# EAGLE design audio_processor (EAGLE 9.6.0)
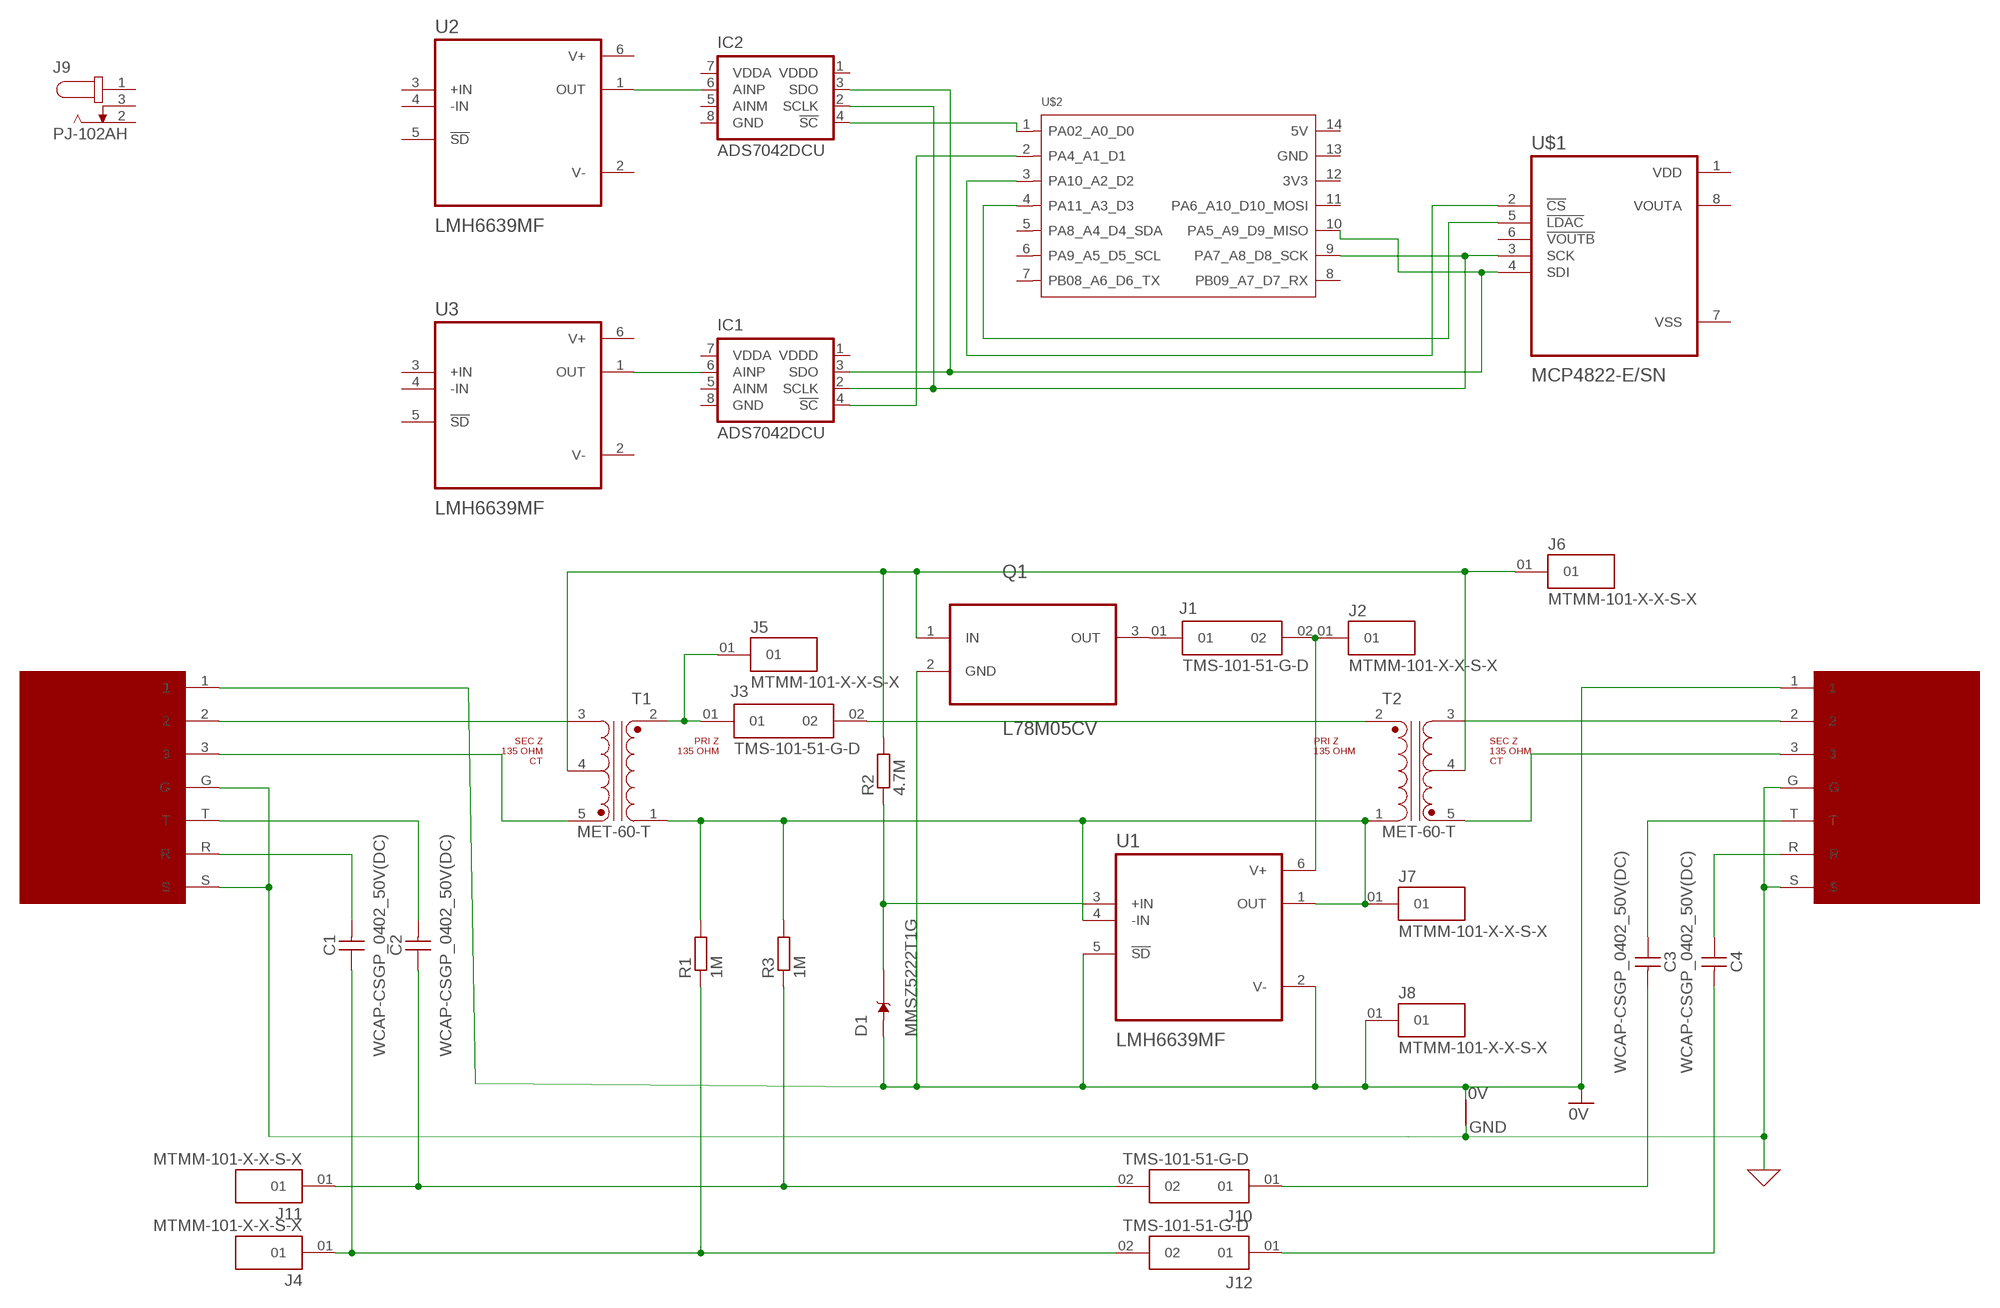
[diagram p0: schematic, sheet 1]

## Parts
B1  NET_BRIDGE  [NET_BRIDGE]
C1  WCAP-CSGP_0402_50V(DC)  [WCAP-CSGP_0402]
C2  WCAP-CSGP_0402_50V(DC)  [WCAP-CSGP_0402]
C3  WCAP-CSGP_0402_50V(DC)  [WCAP-CSGP_0402]
C4  WCAP-CSGP_0402_50V(DC)  [WCAP-CSGP_0402]
C5  XLR-TRS-THRU-HOLE-FEMALE-AMPHENOL  [XLR-TRS-THRU-HOLE-FEMALE-AMPHENOL]
C6  XLR-TRS-THRU-HOLE-FEMALE-AMPHENOL  [XLR-TRS-THRU-HOLE-FEMALE-AMPHENOL]
D1  MMSZ5222T1G  MMSZ4693T1G  [SOD3716X135N]
IC1  ADS7042DCU  [DCU_(R-PDSO-G8)]
IC2  ADS7042DCU  [DCU_(R-PDSO-G8)]
J1  TMS-101-51-G-D  [SAMTEC_TMS-101-51-G-D]
J2  MTMM-101-X-X-S-X  [SAMTEC_MTMM-101-X-X-S-X]
J3  TMS-101-51-G-D  [SAMTEC_TMS-101-51-G-D]
J4  MTMM-101-X-X-S-X  [SAMTEC_MTMM-101-X-X-S-X]
J5  MTMM-101-X-X-S-X  [SAMTEC_MTMM-101-X-X-S-X]
J6  MTMM-101-X-X-S-X  [SAMTEC_MTMM-101-X-X-S-X]
J7  MTMM-101-X-X-S-X  [SAMTEC_MTMM-101-X-X-S-X]
J8  MTMM-101-X-X-S-X  [SAMTEC_MTMM-101-X-X-S-X]
J9  PJ-102AH  [CUI_PJ-102AH]
J10  TMS-101-51-G-D  [SAMTEC_TMS-101-51-G-D]
J11  MTMM-101-X-X-S-X  [SAMTEC_MTMM-101-X-X-S-X]
J12  TMS-101-51-G-D  [SAMTEC_TMS-101-51-G-D]
Q1  L78M05CV  [TO254P450X1020X1935-3P]
R1  1M  R-EU_R0402  [R0402]
R2  4.7M  R-EU_R0402  [R0402]
R3  1M  R-EU_R0402  [R0402]
T1  MET-60-T  [XFMR_MET-60-T]
T2  MET-60-T  [XFMR_MET-60-T]
U1  LMH6639MF  [SOT95P280X145-6N]
U2  LMH6639MF  [SOT95P280X145-6N]
U3  LMH6639MF  [SOT95P280X145-6N]
U$1  MCP4822-E/SN  [SOIC127P599X175-8N]
U$2  SEEED_ESP32_C3  [MOUDLE14P-2.54-21X17.8MM]

## Nets
0V [Power]: B1.P$1 C5.1 C6.1 D1.2(A) J8.01 Q1.2(GND) U1.2(V-) U1.5(!SD)
GND [Power]: B1.P$2 C5.G C5.S C6.G C6.S
N$1 [Power]: C6.2 T1.3
N$2 [Power]: C6.3 T1.5
N$3 [Power]: C5.2 T2.3
N$4 [Power]: C5.3 T2.5
N$5 [Power]: J6.01 Q1.1(IN) R2.2 T1.4 T2.4
N$6: D1.1(C) R2.1 U1.3(+IN)
N$7: J7.01 R1.2 R3.2 T1.1 T2.1 U1.1(OUT) U1.4(-IN)
N$8: C1.1 J4.01 J12.02 R1.1
N$9: J3.01 J5.01 T1.2
N$10: J3.02 T2.2
N$11: C3.2 J10.01
N$12: C4.1 C5.R
N$13: C2.2 C6.T
N$14: J1.01 Q1.3(OUT)
N$15: C1.2 C6.R
N$16: C2.1 J10.02 J11.01 R3.1
N$17: C3.1 C5.T
N$18: C4.2 J12.01
N$19 [Power]: J1.02 J2.01 U1.6(V+)
N$20: U$1.5(!LDAC) U$2.4(PA11_A3_D3)
N$21: IC1.2(SCLK) IC2.2(SCLK) U$1.3(SCK) U$2.9(PA7_A8_D8_SCK)
N$22: IC2.6(AINP) U2.1(OUT)
N$23: IC1.6(AINP) U3.1(OUT)
N$24: IC1.3(SDO) IC2.3(SDO) U$1.4(SDI) U$2.10(PA5_A9_D9_MISO)
N$25: IC1.4(!SC) U$2.2(PA4_A1_D1)
N$26: IC2.4(!SC) U$2.1(PA02_A0_D0)
N$28: U$1.2(!CS) U$2.3(PA10_A2_D2)
Unconnected: IC1.5(AINM) IC2.5(AINM) J9.1 J9.2 J9.3 U2.3(+IN) U2.4(-IN) U2.5(!SD) U3.3(+IN) U3.4(-IN) U3.5(!SD) U$1.6(!VOUTB) U$1.8(VOUTA) U$2.5(PA8_A4_D4_SDA) U$2.6(PA9_A5_D5_SCL) U$2.7(PB08_A6_D6_TX) U$2.8(PB09_A7_D7_RX) U$2.11(PA6_A10_D10_MOSI) U$2.12(3V3) U$2.13(GND) U$2.14(5V)

## Power pins joined to a net without a drawn wire
GND: IC1.8(GND) IC2.8(GND)
V+: U2.6(V+) U3.6(V+)
V-: U2.2(V-) U3.2(V-)
VDD: U$1.1(VDD)
VDDA: IC1.7(VDDA) IC2.7(VDDA)
VDDD: IC1.1(VDDD) IC2.1(VDDD)
VSS: U$1.7(VSS)

## Library data of the parts
B1 = Net_bridge:NET_BRIDGE: Bridge between two, otherwise isolated, nets.
C1-C4 = WCAP-CSGP_0402:WCAP-CSGP_0402: Check availability <https://pricing.snapeda.com/parts/885012105010/W%C3%BCrth%20Elektronik/view-part?ref=eda>; AVAILABILITY: In Stock; CHECK_PRICES: https://www.snapeda.com/parts/885012105010/W%25C3%25BCrth+Elektronik+Midcom/view-part/?ref=eda; DESCRIPTION: WCAP-CSGP General Purpose MLCC; SMT 0402; X5R; 100nF 20%; 10V; -55C to +85C; Tech. PN X5R0402104M010DFCT10000; LCSC: C1581; MF: Würth Elektronik; MP: 885012105010; PACKAGE: 0402 Wurth Electronics; PRICE: None; SNAPEDA_LINK: https://www.snapeda.com/parts/885012105010/W%25C3%25BCrth+Elektronik+Midcom/view-part/?ref=snap
C5 C6 = TM_Lib:XLR-TRS-THRU-HOLE-FEMALE-AMPHENOL: AN AMPHENOL PCB CONNECTOR FOR A COMBINATION OF XLR AND TRS - FEMALE
D1 = MMSZ4693T1G:MMSZ4693T1G: Check availability <https://pricing.snapeda.com/parts/MMSZ4693T1G/ON%20Semiconductor/view-part?ref=eda>; AVAILABILITY: In Stock; CHECK_PRICES: https://www.snapeda.com/parts/MMSZ4693T1G/Onsemi/view-part/?ref=eda; DESCRIPTION: MMSZ4693T1G Zener Diode, 7.5V 5% 500 mW SMT 2-Pin SOD-123 | ON Semiconductor MMSZ4693T1G; LCSC: C150078; MF: ON Semiconductor; MP: MMSZ4693T1G; PACKAGE: SOD-123-2 ON Semiconductor; PRICE: None; SNAPEDA_LINK: https://www.snapeda.com/parts/MMSZ4693T1G/Onsemi/view-part/?ref=snap
IC1 IC2 = Texas Instruments:ADS7042: ADS7042 Ultra-Low Power, Ultra-Small Size, 12-Bit, 1-MSPS, SAR ADC Soure: Data sheet <http://www.ti.com/lit/ds/symlink/ads7042.pdf>
J1 J3 J10 J12 = TMS-101-51-G-D:TMS-101-51-G-D: Check availability <https://pricing.snapeda.com/parts/TMS-101-51-G-D/Samtec/view-part?ref=eda>; AVAILABILITY: In Stock; CHECK_PRICES: https://www.snapeda.com/parts/TMS-101-51-G-D/Samtec/view-part/?ref=eda; DESCRIPTION: Connector Header Through Hole 2 position; MF: Samtec; MP: TMS-101-51-G-D; PACKAGE: None; PRICE: None; SNAPEDA_LINK: https://www.snapeda.com/parts/TMS-101-51-G-D/Samtec/view-part/?ref=snap
J2 J4-J8 J11 = MTMM-101-X-X-S-X:MTMM-101-X-X-S-X: Check availability <https://pricing.snapeda.com/parts/MTMM-101-05-T-S-208/Samtec/view-part?ref=eda>; AVAILABILITY: In Stock; CHECK_PRICES: https://www.snapeda.com/parts/MTMM-101-05-T-S-208/Samtec/view-part/?ref=eda; DESCRIPTION: Connector Header Through Hole 1 position; MF: Samtec; MP: MTMM-101-05-T-S-208; PACKAGE: None; PRICE: None; SNAPEDA_LINK: https://www.snapeda.com/parts/MTMM-101-05-T-S-208/Samtec/view-part/?ref=snap
J9 = PJ-102AH:PJ-102AH: Check availability <https://pricing.snapeda.com/parts/PJ-102AH/Same%20Sky/view-part?ref=eda>; AVAILABILITY: In Stock; CHECK_PRICES: https://www.snapeda.com/parts/PJ-102AH/Same+Sky/view-part/?ref=eda; DESCRIPTION: 2.0 x 6.5 mm, 5.0 A, Horizontal, Through Hole, Tapered Pins, Dc Power Jack Connector; MF: Same Sky; MP: PJ-102AH; PACKAGE: None; PRICE: None; SNAPEDA_LINK: https://www.snapeda.com/parts/PJ-102AH/Same+Sky/view-part/?ref=snap
Q1 = L78M05CV:L78M05CV: Check availability <https://pricing.snapeda.com/parts/L78M05CV/STMicroelectronics/view-part?ref=eda>; AVAILABILITY: In Stock; CHECK_PRICES: https://www.snapeda.com/parts/L78M05CV/STMicroelectronics/view-part/?ref=eda; DESCRIPTION: Linear Voltage Regulator IC Positive Fixed 1 Output 500mA TO-220; LCSC: C283462; MF: STMicroelectronics; MP: L78M05CV; PACKAGE: TO-220-3 STMicroelectronics; PRICE: None; SNAPEDA_LINK: https://www.snapeda.com/parts/L78M05CV/STMicroelectronics/view-part/?ref=snap
R1 R3 = rcl:R-EU_: RESISTOR, European symbol; LCSC: C26083; SPICEPREFIX: R
R2 = rcl:R-EU_: RESISTOR, European symbol; LCSC: C26091; SPICEPREFIX: R
T1 T2 = MET-60-T:MET-60-T: Check availability <https://pricing.snapeda.com/parts/MET-60-T/Triad%20Magnetics/view-part?ref=eda>; AVAILABILITY: In Stock; CHECK_PRICES: https://www.snapeda.com/parts/MET-60-T/Triad+Magnetics/view-part/?ref=eda; DESCRIPTION: 135 Impedance Primary Ohms 135CT Impedance Secondary Ohms 1:1 Audio Transformer 300Hz ~ 100kHz Through Hole; MF: Triad Magnetics; MP: MET-60-T; PACKAGE: None; PRICE: None; SNAPEDA_LINK: https://www.snapeda.com/parts/MET-60-T/Triad+Magnetics/view-part/?ref=snap
U1-U3 = LMH6639MF:LMH6639MF: Check availability <https://pricing.snapeda.com/parts/LMH6639MF/Texas%20Instruments/view-part?ref=eda>; AVAILABILITY: In Stock; CHECK_PRICES: https://www.snapeda.com/parts/LMH6639MF/Texas+Instruments/view-part/?ref=eda; DESCRIPTION: 190MHz Rail-to-Rail Output Amplifier with Disable 6-SOT-23 -40 to 85; LCSC: C131982; MF: Texas Instruments; MP: LMH6639MF; PACKAGE: SOT-23-6 Texas Instruments; PRICE: None; SNAPEDA_LINK: https://www.snapeda.com/parts/LMH6639MF/Texas+Instruments/view-part/?ref=snap
U$1 = MCP4822-E_SN:MCP4822-E/SN: Check availability <https://pricing.snapeda.com/parts/MCP4822-E/SN/Microchip/view-part?ref=eda>; AVAILABILITY: In Stock; CHECK_PRICES: https://www.snapeda.com/parts/MCP4822-E/SN/Microchip/view-part/?ref=eda; DESCRIPTION: Dual 12-Bit Dac With Spi Interace And Internal Vref, Soic-8 | Microchip Technology Inc. MCP4822-E/SN; MF: Microchip; MP: MCP4822-E/SN; PACKAGE: SO-8 Microchip; PRICE: None; SNAPEDA_LINK: https://www.snapeda.com/parts/MCP4822-E/SN/Microchip/view-part/?ref=snap
U$2 = XIAO-ESP32C3:SEEED_ESP32_C3: SEEED ESP C3 internal antenna non-SMD

## Net classes
1 Power: width 0.5 mm

## Board
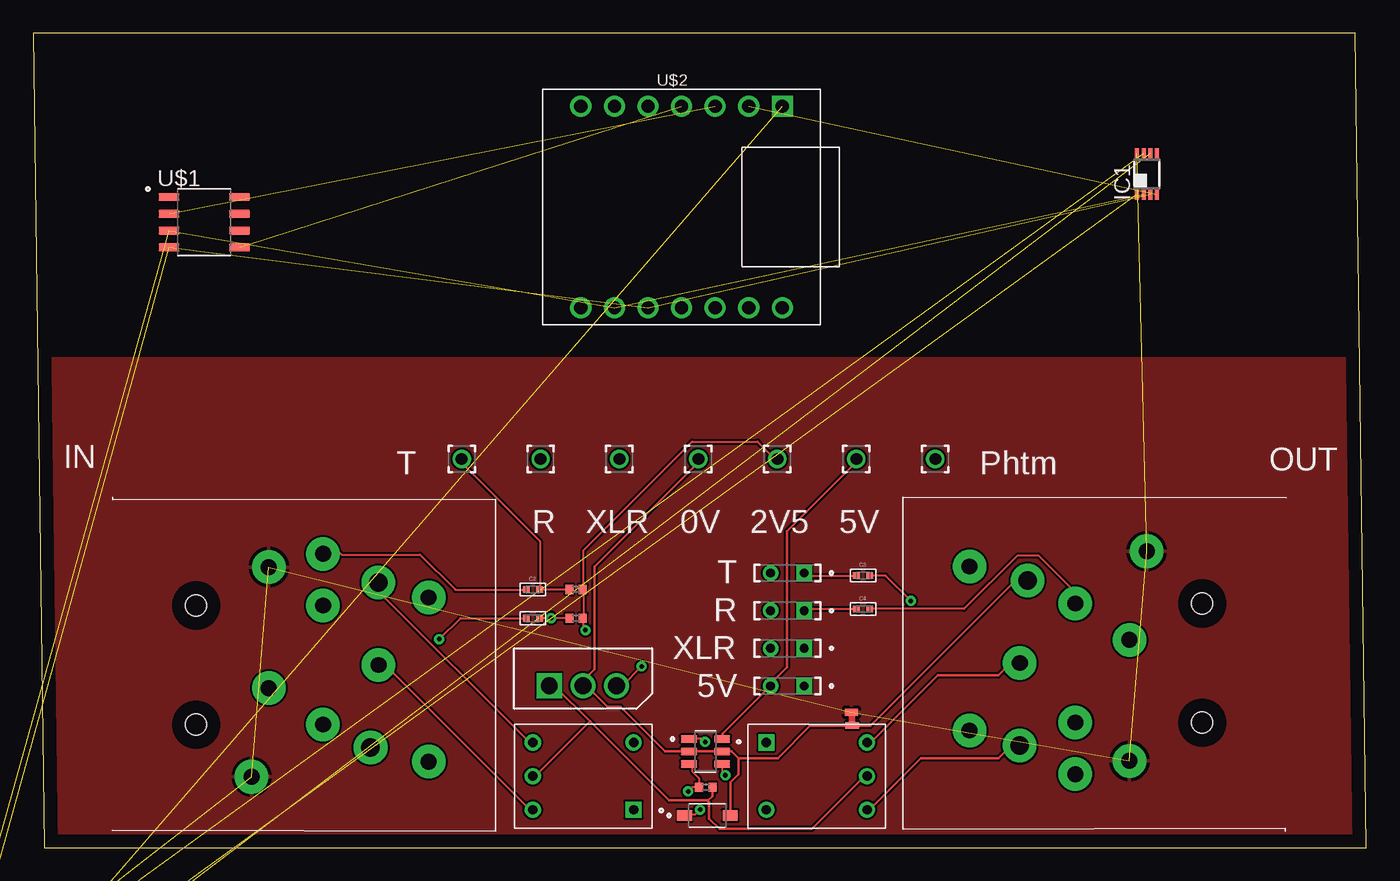
[diagram p1: board, top side]
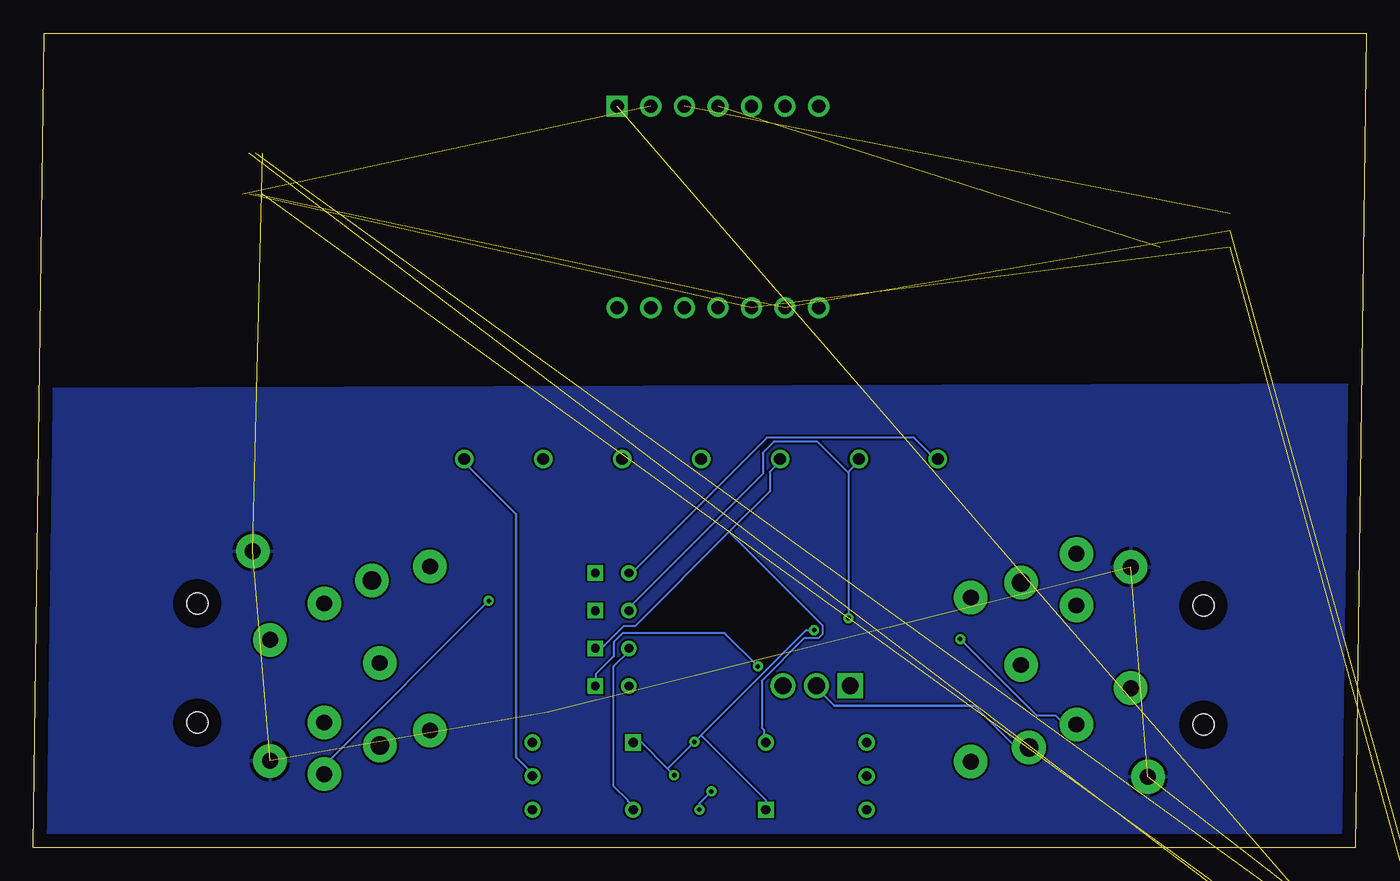
[diagram p2: board, bottom side, seen from below]

Size 100.85 x 61.6 mm. Coordinates in mm from the lower left corner, seen from the top.
Outline: 0.85,0 100.85,0 100,61.6 0,61.6 0.85,0
Copper layers (1*16): Top 0.035mm / dielectric 1.5mm / Bottom 0.035mm
Design rules "default": minimum track width 6mil, minimum drill 0.35mm, track to track 6mil, track to pad 6mil, pad to pad 6mil, via to via 6mil, smd to smd 6mil, copper to edge 40mil, drill to drill 6mil, minimum pad ring 10mil, minimum via ring 8mil, stop-mask expansion 4mil, vias tented up to drill 0mil, thermal gap 10mil

### Footprints (pad centres in the part's own frame; a part is rotated, then mirrored left to right if it is on the bottom)
NET_BRIDGE = smd 1 x 0.5: P$1 -0.025,0.508; P$2 0.025,-0.5
WCAP-CSGP_0402 = smd 0.5 x 0.5: 1 0.5,0; 2 -0.5,0
XLR-TRS-THRU-HOLE-FEMALE-AMPHENOL = drill 1.4 pad 2.54: 1 -6.25,-19.6; 2 6.25,-20.2 | drill 1.2 pad 2.54: 3 0,-20.2; G -8.45,-10.6; GN -1.75,-11.9; R -4.5,-16; RN -7.3,-24; S 7.4,-11.9; SN 4.5,-16; T 8.4,-16; TN 5.1,-24 | hole 1.6: -4.5,-6.4; 4.5,-6.4
SOD3716X135N = smd 1.12 x 0.8: 1 -1.73,0; 2 1.73,0
DCU_(R-PDSO-G8) = smd 0.3 x 0.8: 1 -0.75,-1.55; 2 -0.25,-1.55; 3 0.25,-1.55; 4 0.75,-1.55; 5 0.75,1.55; 6 0.25,1.55; 7 -0.25,1.55; 8 -0.75,1.55
SAMTEC_TMS-101-51-G-D = drill 0.66 pad 1.01 square: 01 0,1.27 | drill 0.66 pad 1.01: 02 0,-1.27
SAMTEC_MTMM-101-X-X-S-X = drill 0.89 pad 1.24: 01 0,0
CUI_PJ-102AH = drill 1 long: 1 -6.5,0; 2 -0.5,0; 3 -3.5,4.7
TO254P450X1020X1935-3P = drill 1.27 square: 1 -5.08,-1.092 | drill 1.27: 2 -2.54,-1.092; 3 0,-1.092
R0402 = smd 0.6 x 0.7: 1 -0.5,0; 2 0.5,0
XFMR_MET-60-T = drill 0.711 pad 1.118 square: 1 -3.81,2.54 | drill 0.711 pad 1.118: 2 -3.81,-2.54; 3 3.81,-2.54; 4 3.81,0; 5 3.81,2.54
SOT95P280X145-6N = smd 1.21 x 0.58: 1 -1.255,0.95; 2 -1.255,0; 3 -1.255,-0.95; 4 1.255,-0.95; 5 1.255,0; 6 1.255,0.95
SOIC127P599X175-8N = smd 1.58 x 0.6: 1 -2.67,1.905; 2 -2.67,0.635; 3 -2.67,-0.635; 4 -2.67,-1.905; 5 2.67,-1.905; 6 2.67,-0.635; 7 2.67,0.635; 8 2.67,1.905
MOUDLE14P-2.54-21X17.8MM = drill 1 pad 1.6 square: 1 7.62,7.62 | drill 1 pad 1.6: 2 5.08,7.62; 3 2.54,7.62; 4 0,7.62; 5 -2.54,7.62; 6 -5.08,7.62; 7 -7.62,7.62; 8 -7.62,-7.62; 9 -5.08,-7.62; 10 -2.54,-7.62; 11 0,-7.62; 12 2.54,-7.62; 13 5.08,-7.62; 14 7.62,-7.62

### Placement (x,y rotation side)
B1  61.93,9.75 180 top
C1  37.8,17.36 0 top
C2  37.8,19.54 0 top
C3  62.78,20.6 0 top
C4  62.78,18.05 0 top
C5  94.83,13.97 270 top
C6  5.93,13.82 90 top
D1  51,2.44 0 top
IC1  84.25,50.95 0 top
IC2  -7.15,-15.1 0 top  (outside the outline)
J1  57.05,12.23 270 top
J2  62.27,29.39 90 top
J3  57.05,15.08 270 top
J4  38.38,29.39 90 top
J5  44.36,29.39 90 top
J6  68.24,29.39 90 top
J7  56.3,29.39 90 top
J8  50.33,29.39 90 top
J9  -1.7,-25.6 0 top  (outside the outline)
J10  57.05,20.78 270 top
J11  32.41,29.39 90 top
J12  57.05,17.93 270 top
Q1  44.13,13.35 0 top
R1  41.07,17.36 0 top
R2  50.88,4.57 0 top
R3  41.07,19.54 0 top
T1  41.61,5.42 180 top
T2  59.27,5.42 0 top
U1  50.87,7.28 0 top
U2  -0.7,-6.75 0 top  (outside the outline)
U3  -0.7,-14.1 0 top  (outside the outline)
U$1  12.95,47.3 0 top
U$2  49.05,48.45 0 top

### Tracks (layer width: path | path; a pad name or v marks a point on that pad's centre or on a via)
0V
  Top 0.2: 53.35,6.78 53.35,5.56 52.74,4.95 52.74,2.52 D1.2 | 53.35,6.78 52.82,7.32 52.13,7.32 U1.5 52.06,7.32 49.62,7.32 U1.2 49.54,7.32 47.79,7.32 44.44,10.67 43.45,10.67 41.69,12.42 Q1.2 41.62,12.27 41.62,12.65 42.45,13.49 42.45,21.26 50.3,29.11 50.3,29.34 J8.01 | 53.35,6.78 56.32,6.78 58.76,9.22 61.85,9.22 63.33,9.22 74.31,20.19 75.22,20.19 C5.1
  Top 0.5: B1.P$1 61.94,9.22 61.85,9.22
  Bottom 0.2: C6.1 25.54,7.62 26.53,7.62 29.65,10.74 40.25,10.74 41.54,12.04 41.54,12.19 Q1.2
GND  (6 unrouted)
  pour Top: -3.95,37.05 102.1,37.05 102.2,36.95 102.2,-1.95 101.35,-2.8 -2,-2.8 -2.45,-2.35 -4.05,-0.75 -4.05,37.15
  pour Bottom: 99.85,34.7 100.65,33.9 100.65,-0.7 101.1,-1.15 -1.75,-1.15 -1.95,-0.95 -1.95,34.85 -1.75,35.05
N$1
  Top 0.2: T1.3 37.73,8 37.5,8 26.15,19.36 26.15,20.04 C6.2
N$2
  Top 0.2: T1.5 37.73,2.9 37.58,2.9 26.68,13.79 26.15,13.79 C6.3
N$3
  Top 0.2: T2.3 63.11,2.9 63.26,2.9 67.14,6.78 73.01,6.78 73.93,7.7 74.61,7.7 C5.2
N$4
  Top 0.2: T2.5 63.11,8 63.41,8 68.44,13.03 73.01,13.03 73.93,13.95 74.61,13.95 C5.3
N$5
  Top 0.2: 51.07,3.58 51.37,3.89 51.37,4.5 R2.2 | 51.07,3.58 48.09,3.58 42.11,9.56 | 42.11,9.56 39.48,12.19 39.1,12.19 Q1.1 | 42.11,9.56 38.04,5.49 37.81,5.49 T1.4 | T2.4 63.03,5.41 62.88,5.41 58.91,1.45 51.9,1.45 51.14,2.21 51.14,3.43 51.07,3.5 51.07,3.58
  Bottom 0.2: J6.01 68.21,29.34 68.21,29.11 64.33,25.22 64.33,6.86 63.11,5.64 63.11,5.49 T2.4
N$6  (via drill 0.35)
  Top 0.152: U1.3 49.85,6.1 49.85,5.79 50.38,5.26 R2.1 50.3,4.57 49.85,4.57 v49.54,4.27 | v50.46,2.9 50.08,2.52 49.31,2.52 D1.1
  Bottom 0.152: v50.46,2.9 50.46,3.35 v49.54,4.27
N$7  (via drill 0.35)
  Top 0.152: v52.36,5.49 52.13,5.71 52.13,6.33 U1.4 | v50.84,8 50.61,8.23 U1.1 | v41.77,16.46 41.62,16.61 41.62,17.3 R1.2 41.62,17.37 41.62,19.51 R3.2 41.62,19.58 41.62,22.48 49.85,30.71 54.8,30.71 56.09,29.41 56.25,29.41 J7.01
  Bottom 0.152: 52.86,5.98 54.88,8 55.41,8 T2.1 | 52.86,5.98 v52.36,5.49 | 52.86,5.98 v50.84,8 50.34,8.5 | v41.77,16.46 42.38,16.46 50.34,8.5 | 50.34,8.5 45.43,3.58 45.43,2.9 T1.1
N$8  (via drill 0.35)
  Top 0.152: C1.1 38.34,17.37 v39.18,17.37 40.55,17.37 R1.1
  Bottom 0.152: 39.18,28.35 39.18,28.42 38.42,29.18 38.42,29.34 J4.01 | 39.18,28.35 v39.18,17.37 | 39.18,28.35 41.54,30.71 44.82,30.71 45.66,29.87 45.66,28.27 55.71,18.21 55.71,17.98 J12.02
N$9
  Bottom 0.152: 48.21,23.89 45.12,26.98 45.12,28.42 44.66,28.88 44.66,29.03 44.36,29.34 J5.01 | 48.21,23.89 55.33,16.76 56.17,16.76 57.85,15.09 58.3,15.09 J3.01 | 48.21,23.89 41.16,16.84 41.16,16.15 41.47,15.85 42.53,15.85 45.73,12.65 45.73,9.07 45.58,8.91 45.58,8.61 45.43,8.46 45.43,8 T1.2
N$10
  Bottom 0.152: J3.02 55.79,15.01 55.79,14.86 56.93,13.72 56.93,4.65 55.87,3.58 55.87,3.5 55.48,3.12 55.48,2.9 T2.2
N$11
  Top 0.152: C3.2 62.27,20.57 58.53,20.57 58.38,20.73 J10.01
N$12
  Top 0.152: C4.1 63.33,18.06 70.42,18.06 74.46,22.1 76.06,22.1 78.8,19.36 78.8,18.52 C5.R
N$13
  Top 0.152: C2.2 37.27,19.51 31.94,19.51 29.27,22.17 23.33,22.17 23.18,22.33 22.03,22.33 21.96,22.25 C6.T
N$14  (via drill 0.35)
  Top 0.152: v46.04,13.72 44.59,12.27 Q1.3
  Bottom 0.152: v46.04,13.72 48.55,16.23 56.25,16.23 56.93,15.54 56.93,14.48 58.3,13.11 58.3,12.27 J1.01
N$15  (via drill 0.35)
  Top 0.152: v30.72,15.77 32.32,17.37 37.27,17.37 C1.2
  Bottom 0.152: v30.72,15.77 24.93,9.98 23.48,9.98 22.87,9.37 21.96,9.37 C6.R
N$16
  Top 0.152: R3.1 40.55,19.51 38.34,19.51 C2.1 38.34,19.58 38.34,23.16 32.47,29.03 32.47,29.34 J11.01
  Bottom 0.152: J10.02 55.71,20.8 55.56,20.8 45.35,31.01 34.23,31.01 32.62,29.41 32.47,29.41 J11.01
N$17  (via drill 0.35)
  Top 0.152: v66.38,18.67 64.48,20.57 63.33,20.57 C3.1
  Bottom 0.152: v66.38,18.67 78.8,6.25 78.8,5.64 C5.T
N$18
  Top 0.152: C4.2 62.27,18.06 58.46,18.06 58.38,17.98 J12.01
N$19
  Top 0.2: U1.6 52.13,8.31 52.13,8.61 55.71,12.19 J1.02 55.87,12.27 55.87,12.5 57.01,13.64 57.01,23.93 62.27,29.18 62.27,29.34 J2.01
N$20  (1 unrouted)
N$21  (3 unrouted)
N$22  (1 unrouted)
N$23  (1 unrouted)
N$24  (3 unrouted)
N$25  (1 unrouted)
N$26  (1 unrouted)
N$28  (1 unrouted)
V+  (1 unrouted)
V-  (1 unrouted)
VDDA  (1 unrouted)
VDDD  (1 unrouted)

### Text on the board
tNames: IN | OUT | T | Phtm | R | XLR | 0V | 2V5 | 5V | T | R | XLR | 5V